# Altium schematic sheet E-44 IPS TX.SchDoc: E-44 IPS Transmitter
size B; DrawnBy: Jeremie Boulianne; Organization: Synthiam Inc.; Address1: Unit 10. 6120 - 11 St. SE; Address2: Calgary, AB; Address3: T2H 2L7; Address4: Canada; Revision: 0
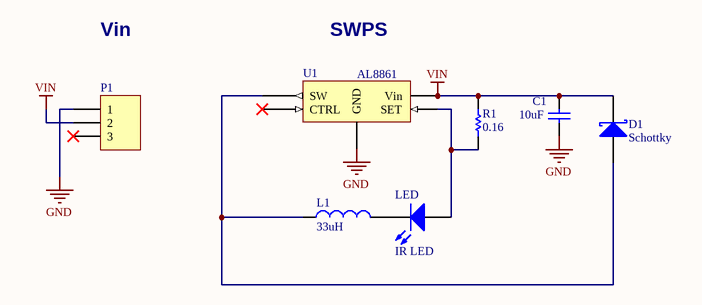
[diagram p0: E-44 IPS TX.SchDoc]

## Parts
C1  10uF  [0603 TIGHT]
D1  Schottky  [DIODE SOD-123]
L1  value 33uH  [IND SMD LRG]  (hidden comment: Ferrite)
LED  IR LED  [IR LED]
P1  Header 3  [JST-PH 3-pin SMD]  (value not drawn)
R1  value 0.16  [0603 tight]  (hidden comment: Res1)
U1  AL8861  [SOT-25 new]

## Nets
GND: C1.1 P1.1 U1.3(GND)
VIN: C1.2 D1.2(K) P1.2 R1.2 U1.2(Vin)
NetD1_1: D1.1(A) L1.1 U1.5(SW)
NetL1_2: L1.2 LED.2(K)
NetLED_1: LED.1(A) R1.1 U1.1(SET)

Not connected (* = marked no-connect by the designer): P1 3*; U1 4(CTRL)*

## Notes on the sheet
- Vin
- SWPS
- Property of:
- Size:
- Date:
- B
- Drawn By:
- Time:
- Revision:
- Copyright © 2019 Synthiam Inc. All rights reserved.

## Library data of the parts
C1 = Cap: Capacitor; Published: 8-Jun-2000; LatestRevisionDate: 17-Jul-2002; LatestRevisionNote: Re-released for DXP Platform.; PackageReference: RAD-0.3; Publisher: Altium Limited
D1 = D Schottky: Schottky Diode; Published: 8-Jun-2000; LatestRevisionDate: 17-Jul-2002; LatestRevisionNote: Re-released for DXP Platform.; PackageReference: SMB; Publisher: Altium Limited; Code_JEDEC: DO-214-AA
L1 = Inductor: Code_IEC: 1005; Published: 8-Jun-2000; LatestRevisionDate: 29-May-2009; LatestRevisionNote: IPC-7351 Footprint Added.; PackageReference: 0402-A; Publisher: Altium Limited; PackageDescription: Chip Inductor; Code_JEITA: 0402
P1 = Header 3: Header, 3-Pin; LatestRevisionDate: 17-Jul-2002; LatestRevisionNote: Re-released for DXP Platform.; Publisher: Altium Limited
R1 = Res1: Resistor; Published: 8-Jun-2000; LatestRevisionDate: 17-Jul-2002; LatestRevisionNote: Re-released for DXP Platform.; PackageReference: AXIAL-0.3; Publisher: Altium Limited
U1 = AL8860